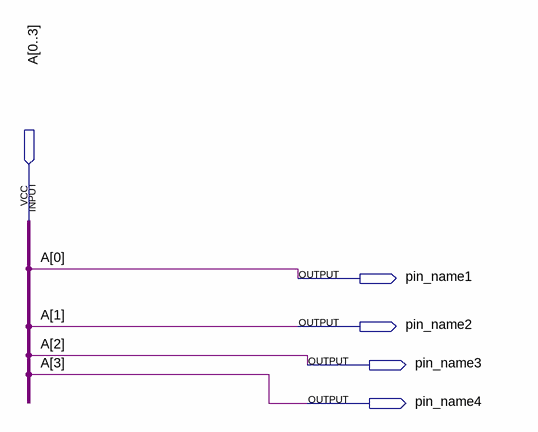
[diagram p0: schematic sheet]
// Quartus schematic in1_out3.bdf as structural Verilog: 0 symbols, 5 pins
module in1_out3 (
  input  [0:3] A,
  output pin_name1,
  output pin_name2,
  output pin_name3,
  output pin_name4
);


  assign pin_name1 = A[0];
  assign pin_name2 = A[1];
  assign pin_name3 = A[2];
  assign pin_name4 = A[3];
endmodule
